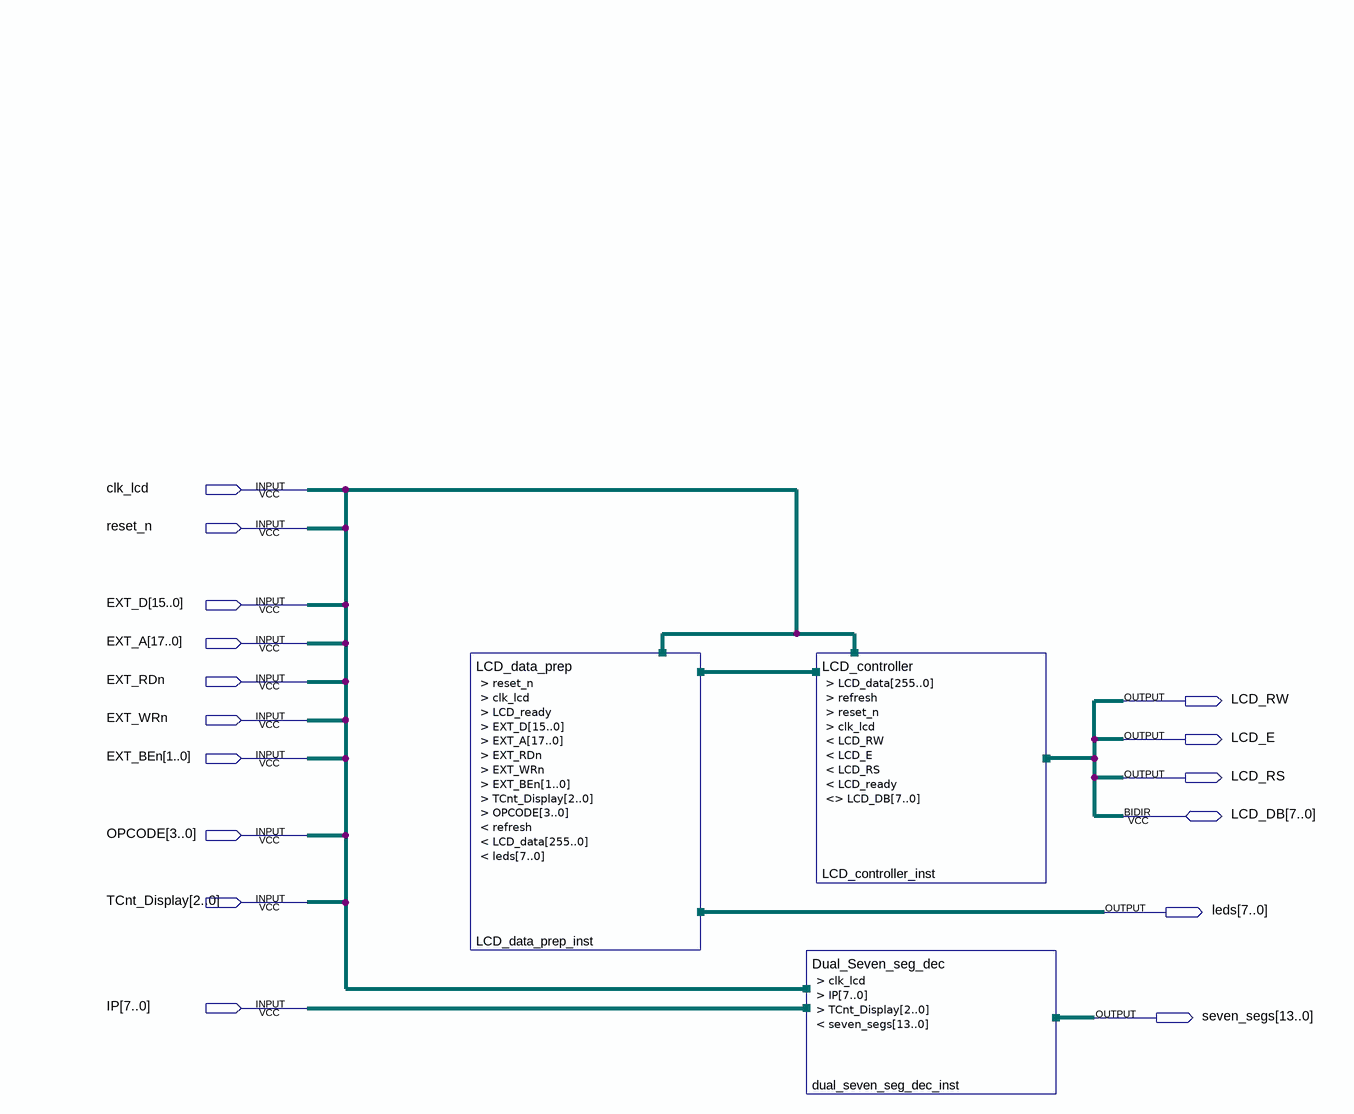
[diagram p0: schematic sheet]
// Quartus schematic disp.bdf as structural Verilog: 3 symbols, 16 pins
module disp (
  input  clk_lcd,
  input  reset_n,
  input  [15:0] EXT_D,
  input  [17:0] EXT_A,
  input  EXT_RDn,
  input  EXT_WRn,
  input  [1:0] EXT_BEn,
  input  [3:0] OPCODE,
  input  [2:0] TCnt_Display,
  input  [7:0] IP,
  inout  [7:0] LCD_DB,
  output LCD_RW,
  output LCD_E,
  output LCD_RS,
  output [7:0] leds,
  output [13:0] seven_segs
);

  wire LCD_ready, refresh;
  wire [255:0] LCD_data;

  LCD_data_prep LCD_data_prep_inst (
    .reset_n(reset_n), .clk_lcd(clk_lcd), .LCD_ready(LCD_ready), .EXT_D(EXT_D), .EXT_A(EXT_A),
    .EXT_RDn(EXT_RDn), .EXT_WRn(EXT_WRn), .EXT_BEn(EXT_BEn), .TCnt_Display(TCnt_Display), .OPCODE(OPCODE),
    .refresh(refresh), .LCD_data(LCD_data), .leds(leds));
  LCD_controller LCD_controller_inst (
    .LCD_data(LCD_data), .refresh(refresh), .reset_n(reset_n), .clk_lcd(clk_lcd), .LCD_RW(LCD_RW),
    .LCD_E(LCD_E), .LCD_RS(LCD_RS), .LCD_ready(LCD_ready), .LCD_DB(LCD_DB));
  Dual_Seven_seg_dec dual_seven_seg_dec_inst (
    .clk_lcd(clk_lcd), .IP(IP), .TCnt_Display(TCnt_Display), .seven_segs(seven_segs));
endmodule
